# Altium project Numark NS7 Regulator Board.PrjPcb
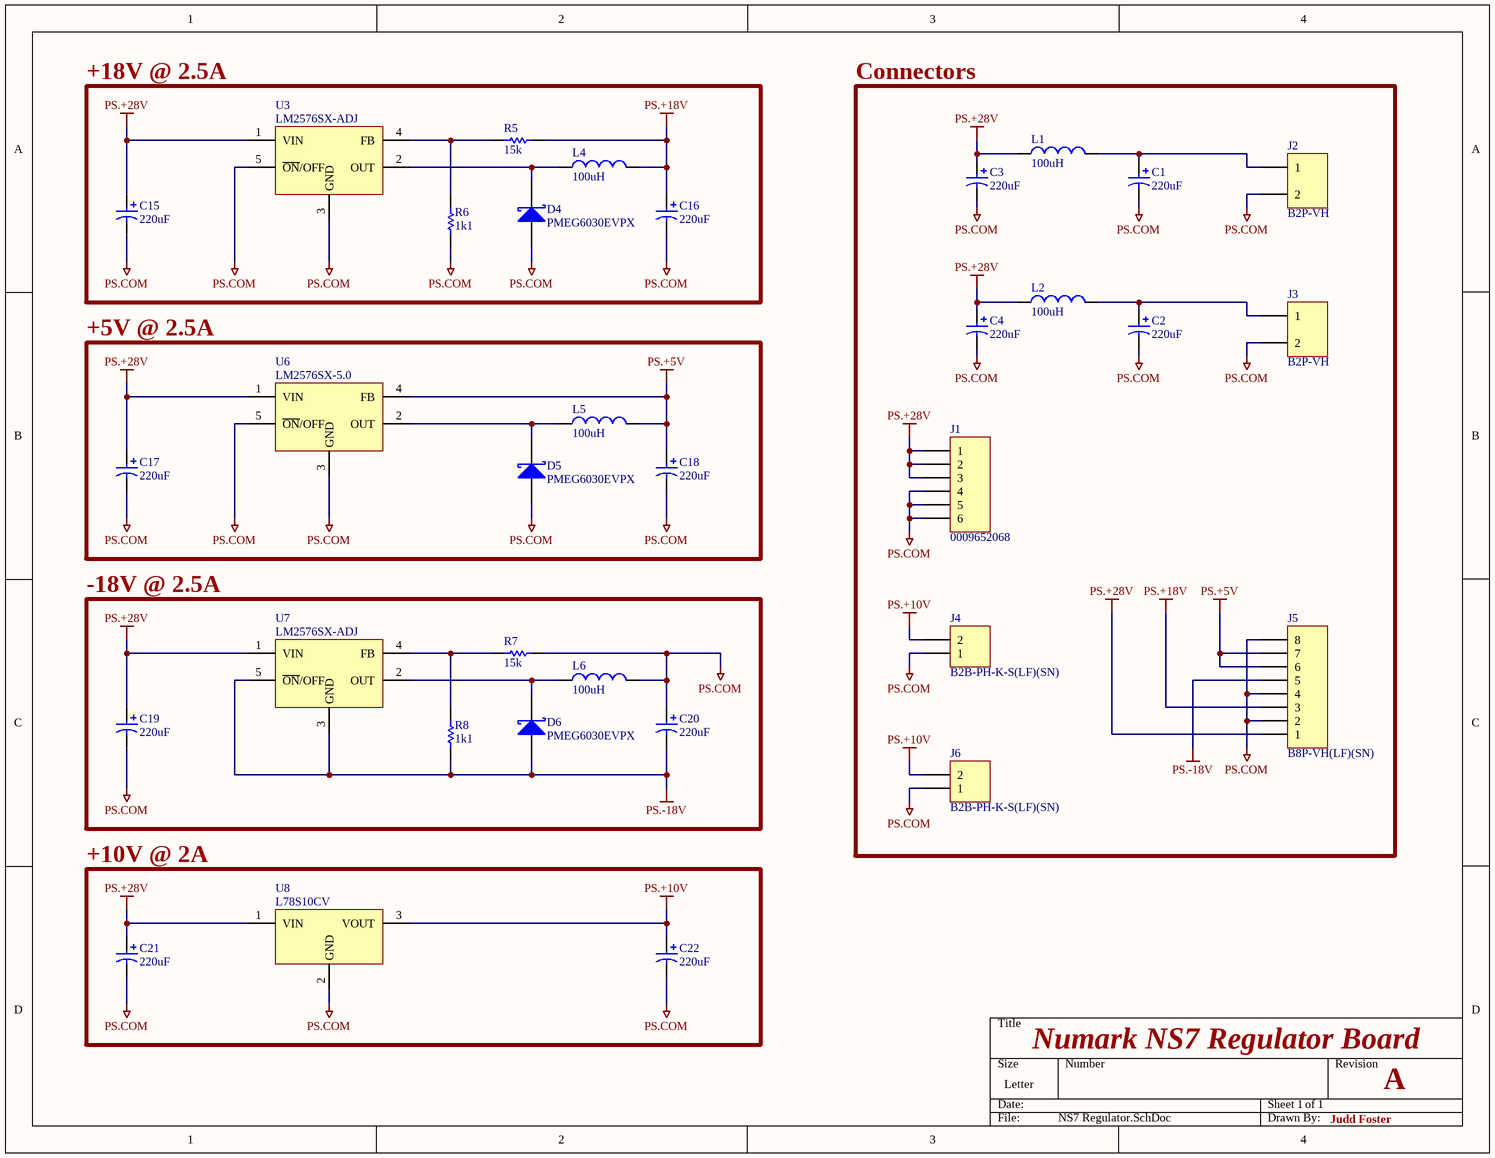
[diagram p0: NS7 Regulator.SchDoc]
1 sheet, 34 parts. Net scope: global (net labels, ports and power ports of the same name join across sheets).
Board file: NS7 Regulator.PcbDoc

## Sheet NS7 Regulator.SchDoc: Numark NS7 Regulator Board
size Letter; Author: Judd Foster; DrawnBy: Judd Foster; Engineer: Judd Foster; Revision: A; SheetNumber: 1; SheetTotal: 1

### Parts
C1  220uF  [Cap,Alum,Thru,D10,H17.5]
C2  220uF  [Cap,Alum,Thru,D10,H17.5]
C3  220uF  [Cap,Alum,Thru,D10,H17.5]
C4  220uF  [Cap,Alum,Thru,D10,H17.5]
C15  220uF  [Cap,Alum,Thru,D10,H17.5]
C16  220uF  [Cap,Alum,Thru,D10,H17.5]
C17  220uF  [Cap,Alum,Thru,D10,H17.5]
C18  220uF  [Cap,Alum,Thru,D10,H17.5]
C19  220uF  [Cap,Alum,Thru,D10,H17.5]
C20  220uF  [Cap,Alum,Thru,D10,H17.5]
C21  220uF  [Cap,Alum,Thru,D10,H17.5]
C22  220uF  [Cap,Alum,Thru,D10,H17.5]
D4  PMEG6030EVPX  [SOD128]
D5  PMEG6030EVPX  [SOD128]
D6  PMEG6030EVPX  [SOD128]
J1  0009652068  [MOLEX_0009652068]
J2  B2P-VH  [JST_B2P-VH]
J3  B2P-VH  [JST_B2P-VH]
J4  B2B-PH-K-S(LF)(SN)  [JST_B2B-PH-K-S]
J5  B8P-VH(LF)(SN)  [JST_B8P-VH]
J6  B2B-PH-K-S(LF)(SN)  [JST_B2B-PH-K-S]
L1  100uH  [IND,WIREWOUND,12x12,SMD]
L2  100uH  [IND,WIREWOUND,12x12,SMD]
L4  100uH  [IND,WIREWOUND,12x12,SMD]
L5  100uH  [IND,WIREWOUND,12x12,SMD]
L6  100uH  [IND,WIREWOUND,12x12,SMD]
R5  15k  [RES,0402]
R6  1k1  [RES,0402]
R7  15k  [RES,0402]
R8  1k1  [RES,0402]
U3  LM2576SX-ADJ  [TO263-5]
U6  LM2576SX-5.0  [TO263-5]
U7  LM2576SX-ADJ  [TO263-5]
U8  L78S10CV  [TO-220,PCB Mount]

### Blocks framed on the sheet
+18V @ 2.5A: C15 C16 D4 L4 R5 R6 U3
Connectors: C1-C4 J1-J6 L1 L2
+5V @ 2.5A: C17 C18 D5 L5 U6
-18V @ 2.5A: C19 C20 D6 L6 R7 R8 U7
+10V @ 2A: C21 C22 U8

### Nets
PS.+5V: C18.1 J5.6 J5.7 L5.2 U6.4(FB)
PS.+10V: C22.1 J4.2 J6.2 U8.3(VOUT)
PS.+18V: C16.1 J5.3 L4.2 R5.2
PS.+28V: C3.1 C4.1 C15.1 C17.1 C19.1 C21.1 J1.1 J1.2 J1.3 J5.1 L1.1 L2.1 U3.1(VIN) U6.1(VIN) U7.1(VIN) U8.1(VIN)
PS.-18V: C20.2 D6.2(A) J5.5 R8.1 U7.3(GND) U7.5(~{ON}/OFF)
PS.COM: C1.2 C2.2 C3.2 C4.2 C15.2 C16.2 C17.2 C18.2 C19.2 C20.1 C21.2 C22.2 D4.2(A) D5.2(A) J1.4 J1.5 J1.6 J2.2 J3.2 J4.1 J5.2 J5.4 J5.8 J6.1 L6.2 R6.1 R7.2 U3.3(GND) U3.5(~{ON}/OFF) U6.3(GND) U6.5(~{ON}/OFF) U8.2(GND)
NetC1_1: C1.1 J2.1 L1.2
NetC2_1: C2.1 J3.1 L2.2
NetD4_1: D4.1(K) L4.1 U3.2(OUT)
NetD5_1: D5.1(K) L5.1 U6.2(OUT)
NetD6_1: D6.1(K) L6.1 U7.2(OUT)
NetR5_1: R5.1 R6.2 U3.4(FB)
NetR7_1: R7.1 R8.2 U7.4(FB)

### Library data of the parts
C1-C4 C15-C22 = CAP,Alum,220uF,50VDC,Radial,Thru: 220 µF 50 V Aluminum Electrolytic Capacitors Radial, Can 5000 Hrs @ 105°C; Vendor Part Number: 1189-3771-1-ND; Manufacturer: Rubycon; Manufacturer Part Number: 50YXG220MEFCT810X16; Vendor: Digikey; HelpURL: https://www.rubycon.co.jp/wp-content/uploads/catalog-aluminum/YXG.pdf; CreatedBy: Judd Foster
D4-D6 = DIODE,Schottky,60V,3A,SMD: DIODE SCHOTTKY 60V 3A SOD128; Manufacturer: Nexperia USA Inc.; Vendor Part Number: 1727-1349-1-ND; Vendor: Digikey; CreatedBy: Judd Foster; HelpURL: https://assets.nexperia.com/documents/data-sheet/PMEG6030EVP.pdf; Manufacturer Part Number: PMEG6030EVPX
J1 = Conn,Header,Molex,KK,6Pin,3.96mm,Thru: Connector Header Through Hole 6 position 0.156" (3.96mm); Manufacturer: Molex; Vendor Part Number: WM18827-ND; Vendor: DigiKey; CreatedBy: Judd Foster; HelpURL: https://www.molex.com/pdm_docs/sd/009652068_sd.pdf; Manufacturer Part Number: 0009652068
J2 J3 = Conn,Header,JST,VH,2Pin,3.96mm,Thru: 1x2P VH 1 3.96mm 2 Brass Plugin,P=3.96mm Wire To Board / Wire To Wire Connector ROHS; Manufacturer: JST Sales America; Vendor Part Number: C160315; Vendor: LCSC; CreatedBy: Judd Foster; HelpURL: https://datasheet.lcsc.com/lcsc/2304140030_JST-Sales-America-B2P-VH-LF-SN_C160315.pdf; Manufacturer Part Number: B2P-VH
J4 J6 = Conn,Header,JST,PH,2Pin,2mm,Thru: 1x2P PH 1 2mm 2 Brass Plugin,P=2mm Wire To Board / Wire To Wire Connector ROHS; Manufacturer: JST Sales America; Vendor Part Number: C131337; Vendor: LCSC; CreatedBy: Judd Foster; HelpURL: https://datasheet.lcsc.com/lcsc/2304140030_JST-Sales-America-B2B-PH-K-S-LF-SN_C131337.pdf; Manufacturer Part Number: B2B-PH-K-S
J5 = Conn,Header,JST,VH,8Pin,3.96mm,Thru: 1x8P VH 1 3.96mm 8 Brass Plugin,P=3.96mm Wire To Board / Wire To Wire Connector ROHS; Manufacturer: JST Sales America; Vendor Part Number: C160320; Vendor: LCSC; CreatedBy: Judd Foster; HelpURL: https://datasheet.lcsc.com/lcsc/2304140030_JST-Sales-America-B8P-VH-LF-SN_C160320.pdf; Manufacturer Part Number: B8P-VH
L1 L2 L4-L6 = IND,100uH,2.5A,Wirewound,SMD: FIXED IND 100UH 2.5A 110 MOHM; Vendor Part Number: 732-1248-1-ND; Manufacturer: Würth Elektronik; Manufacturer Part Number: 7447709101; Vendor: Digikey; HelpURL: https://www.we-online.de/katalog/datasheet/7447709101.pdf; CreatedBy: Judd Foster
R5 R7 = RES,15k,1%,0.1W,0402: 15 kOhms ±1% 0.063W, 1/16W Chip Resistor 0402 (1005 Metric) Thick Film; Manufacturer: Walsin Technology Corporation; Manufacturer Part Number: WR04X1502FTL; Vendor Part Number: 1292-WR04X1502FTLCT-ND; Vendor: Digikey; CreatedBy: Judd Foster; HelpURL: http://www.passivecomponent.com/wp-content/uploads/chipR/ASC_WR.pdf
R6 R8 = RES,1k1,1%,0.063W,0402: 1.1 kOhms ±1% 0.063W, 1/16W Chip Resistor 0402 (1005 Metric) Moisture Resistant Thick Film; Manufacturer: Yageo; Manufacturer Part Number: RC0402FR-071K1L; Vendor Part Number: 311-1.10KLRCT-ND; Vendor: Digikey; CreatedBy: Judd Foster; HelpURL: https://www.yageo.com/upload/media/product/productsearch/datasheet/rchip/PYu-RC_Group_51_RoHS_L_12.pdf
U3 U7 = LM2576SX-ADJ: Buck Switching Regulator IC Positive Adjustable 1.23V 1 Output 3A TO-263-6, D²Pak (5 Leads + Tab), TO-263BA; Manufacturer Part Number: LM2576SX-ADJ/NOPB; Manufacturer: Texas Instruments; Vendor Part Number: LM2576SX-ADJ/NOPBCT-ND; Vendor: Digikey; CreatedBy: Judd Foster; HelpURL: http://www.ti.com/lit/ds/symlink/lm2576hv.pdf
U6 = LM2576SX-5.0: Buck Switching Regulator IC Positive Fixed 5V 1 Output 3A TO-263-6, D²Pak (5 Leads + Tab), TO-263BA; Manufacturer Part Number: LM2576SX-5.0/NOPB; Manufacturer: Texas Instruments; Vendor Part Number: LM2576SX-5.0/NOPBCT-ND; Vendor: Digikey; CreatedBy: Judd Foster; HelpURL: http://www.ti.com/lit/ds/symlink/lm2576hv.pdf
U8 = L78S10CV: Linear Voltage Regulator IC Positive Fixed 1 Output 2A TO-220; Manufacturer: STMicroelectronics; Vendor Part Number: 497-6039-5-ND; Vendor: Digikey; CreatedBy: Judd Foster; HelpURL: https://www.st.com/content/ccc/resource/technical/document/datasheet/e9/be/53/a3/1f/6f/4f/75/CD00000449.pdf/files/CD00000449.pdf/jcr:content/translations/en.CD00000449.pdf; Manufacturer Part Number: L78S10CV